# EAGLE schematic maosdik (EAGLE 9.0.1)
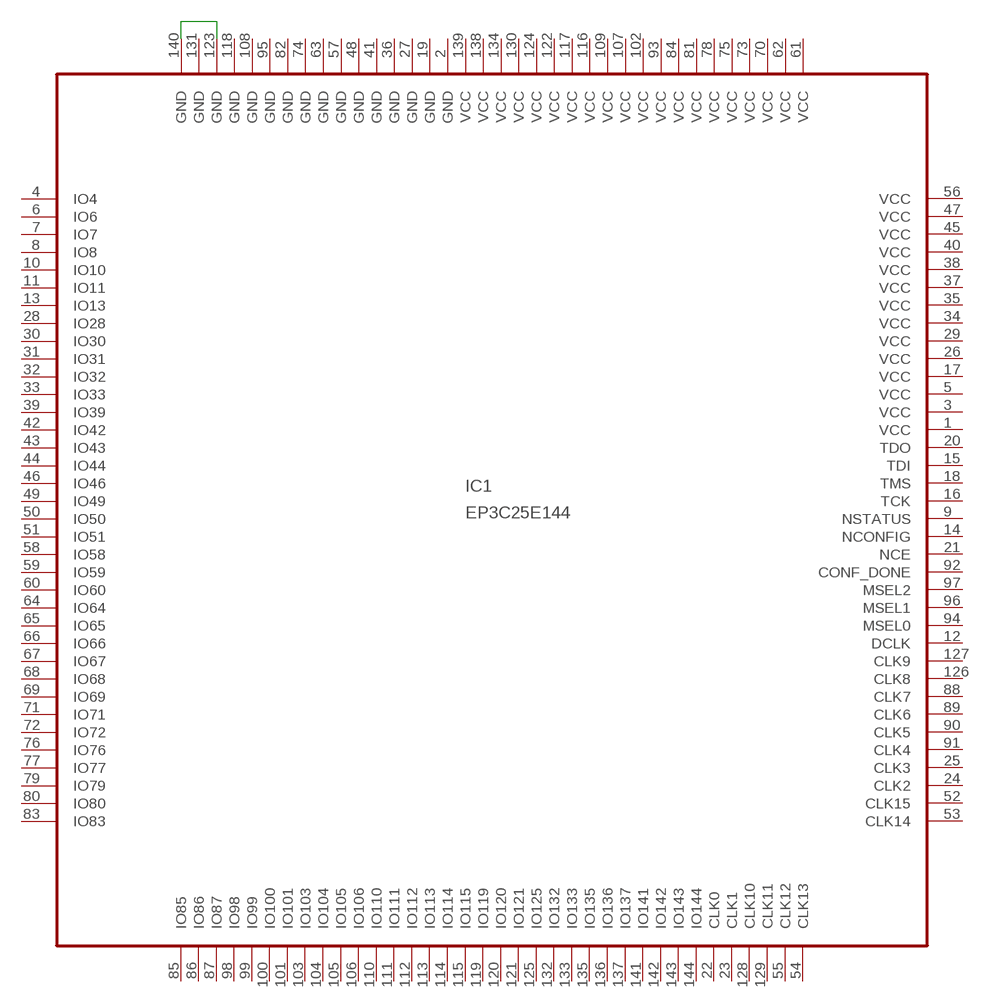
[diagram p0: schematic, sheet 1]

## Parts
IC1  EP3C25E144  [EQFP144]

## Nets
N$1: IC1.123(GND) IC1.140(GND)
Unconnected: IC1.4(IO4) IC1.6(IO6) IC1.7(IO7) IC1.8(IO8) IC1.9(NSTATUS) IC1.10(IO10) IC1.11(IO11) IC1.12(DCLK) IC1.13(IO13) IC1.14(NCONFIG) IC1.15(TDI) IC1.16(TCK) IC1.18(TMS) IC1.20(TDO) IC1.21(NCE) IC1.22(CLK0) IC1.23(CLK1) IC1.24(CLK2) IC1.25(CLK3) IC1.28(IO28) IC1.30(IO30) IC1.31(IO31) IC1.32(IO32) IC1.33(IO33) IC1.39(IO39) IC1.42(IO42) IC1.43(IO43) IC1.44(IO44) IC1.46(IO46) IC1.49(IO49) IC1.50(IO50) IC1.51(IO51) IC1.52(CLK15) IC1.53(CLK14) IC1.54(CLK13) IC1.55(CLK12) IC1.58(IO58) IC1.59(IO59) IC1.60(IO60) IC1.64(IO64) IC1.65(IO65) IC1.66(IO66) IC1.67(IO67) IC1.68(IO68) IC1.69(IO69) IC1.71(IO71) IC1.72(IO72) IC1.76(IO76) IC1.77(IO77) IC1.79(IO79) IC1.80(IO80) IC1.83(IO83) IC1.85(IO85) IC1.86(IO86) IC1.87(IO87) IC1.88(CLK7) IC1.89(CLK6) IC1.90(CLK5) IC1.91(CLK4) IC1.92(CONF_DONE) IC1.94(MSEL0) IC1.96(MSEL1) IC1.97(MSEL2) IC1.98(IO98) IC1.99(IO99) IC1.100(IO100) IC1.101(IO101) IC1.103(IO103) IC1.104(IO104) IC1.105(IO105) IC1.106(IO106) IC1.110(IO110) IC1.111(IO111) IC1.112(IO112) IC1.113(IO113) IC1.114(IO114) IC1.115(IO115) IC1.119(IO119) IC1.120(IO120) IC1.121(IO121) IC1.125(IO125) IC1.126(CLK8) IC1.127(CLK9) IC1.128(CLK10) IC1.129(CLK11) IC1.132(IO132) IC1.133(IO133) IC1.135(IO135) IC1.136(IO136) IC1.137(IO137) IC1.141(IO141) IC1.142(IO142) IC1.143(IO143) IC1.144(IO144)

## Power pins joined to a net without a drawn wire
GND: IC1.2(GND) IC1.19(GND) IC1.27(GND) IC1.36(GND) IC1.41(GND) IC1.48(GND) IC1.57(GND) IC1.63(GND) IC1.74(GND) IC1.82(GND) IC1.95(GND) IC1.108(GND) IC1.118(GND) IC1.131(GND)
VCC: IC1.1(VCC) IC1.3(VCC) IC1.5(VCC) IC1.17(VCC) IC1.26(VCC) IC1.29(VCC) IC1.34(VCC) IC1.35(VCC) IC1.37(VCC) IC1.38(VCC) IC1.40(VCC) IC1.45(VCC) IC1.47(VCC) IC1.56(VCC) IC1.61(VCC) IC1.62(VCC) IC1.70(VCC) IC1.73(VCC) IC1.75(VCC) IC1.78(VCC) IC1.81(VCC) IC1.84(VCC) IC1.93(VCC) IC1.102(VCC) IC1.107(VCC) IC1.109(VCC) IC1.116(VCC) IC1.117(VCC) IC1.122(VCC) IC1.124(VCC) IC1.130(VCC) IC1.134(VCC) IC1.138(VCC) IC1.139(VCC)

## Library data of the parts
IC1 = altera-cyclone-III:EP3C25E144: EP3C25E144 edit this description Auto generated by make-symbol-device-package-bsdl.ulp Rev. 20 Source: EP3C25E144.bsd http://www.altera.com/support/devices/bsdl/cyclone3/cyc3-index.jsp; MPN: EP3C25E144C8N; OC_FARNELL: 1453474; OC_NEWARK: 51R0605